# EasyEDA Pro project Source_Boat_Transmitter.epro

# Schematic Schematic1
Board Name: Board1; Create Date: 2026-06-01; Page Name: P1; Project Name: New Project_2026-06-01_17-34-28; Schematic Name: Schematic1; Update Date: 2026-06-07; Company: EasyEDA.com; Page Size: A4; Version: V1.0
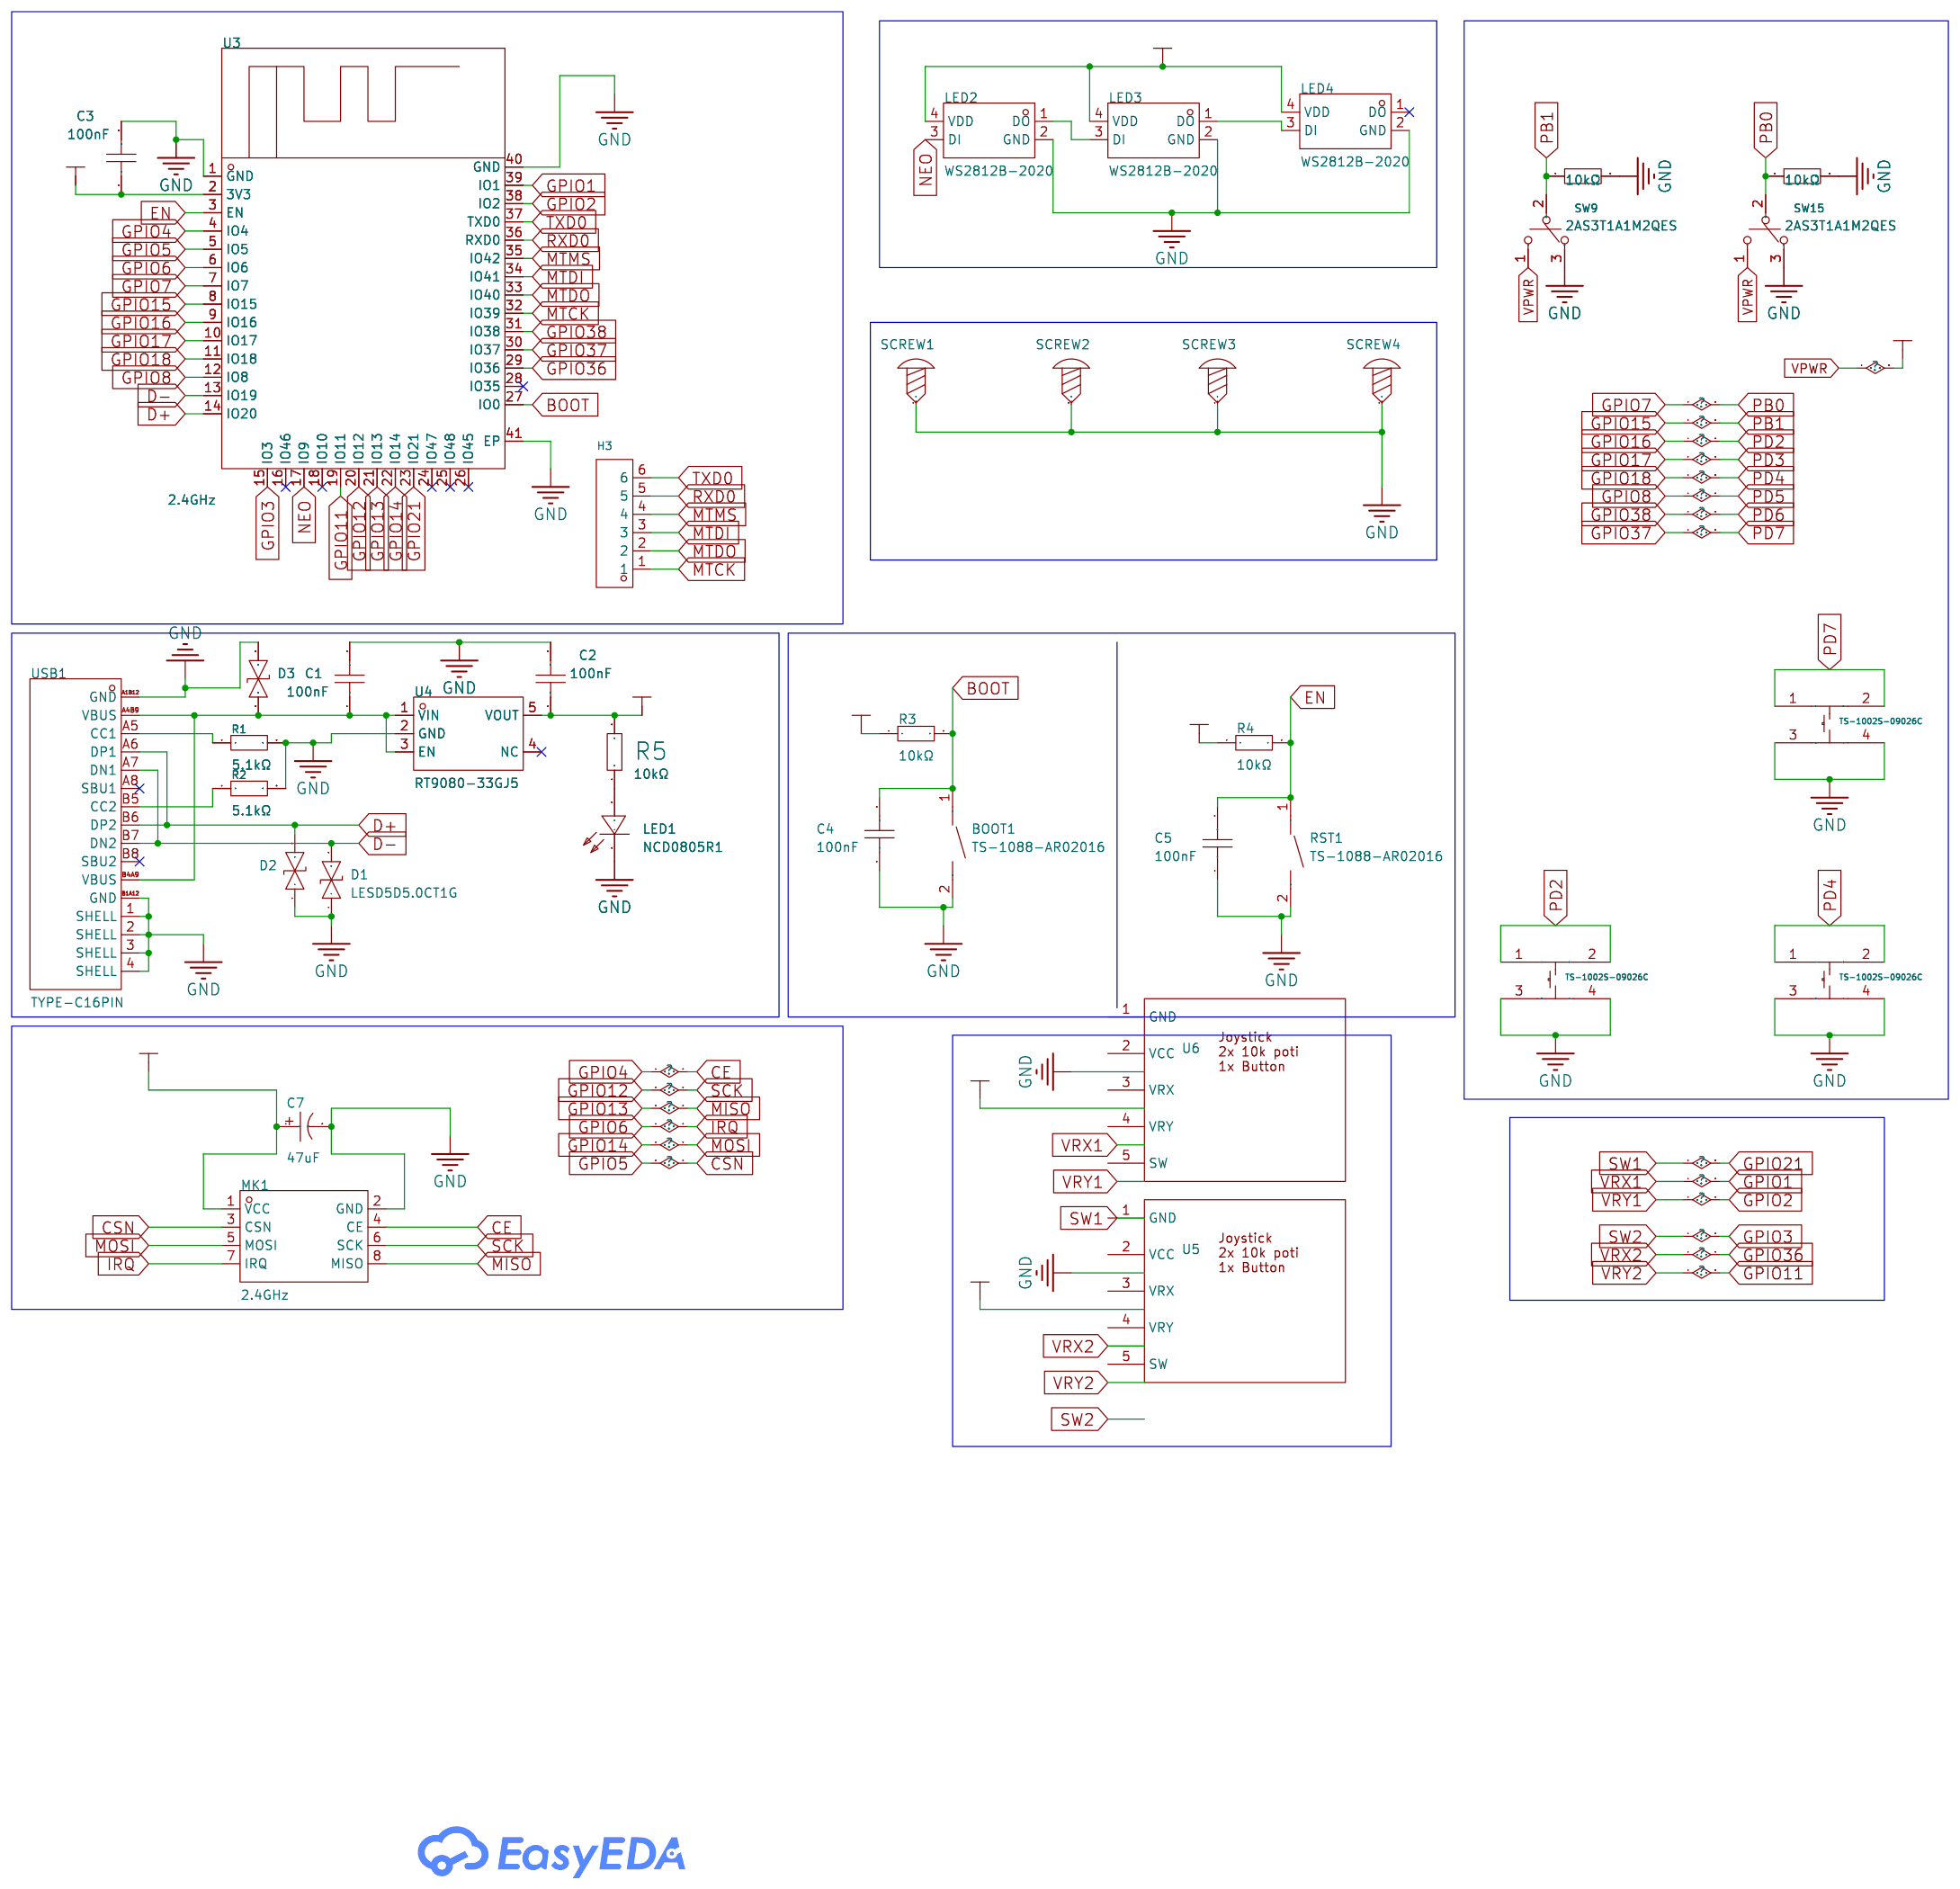
[diagram p0: schematic sheet]

## Parts
BOOT1  TS-1088-AR02016  [SW-SMD_L3.9-W3.0-P4.45]
C1  100nF  [R0603_NEW]
C2  100nF  [R0603_NEW]
C3  100nF  [R0603_NEW]
C4  100nF  [R0603_NEW]
C5  100nF  [R0603_NEW]
C7  47uF  [CAP-SMD_BD6.3-L6.6-W6.6-FD]
D1  LESD5D5.0CT1G  [SOD-523_L1.2-W0.8-LS1.6-BI]
D2  LESD5D5.0CT1G  [SOD-523_L1.2-W0.8-LS1.6-BI]
D3  LESD5D5.0CT1G  [SOD-523_L1.2-W0.8-LS1.6-BI]
H3  -  [HDR-TH_6P-P2.54-V-F]
LED1  NCD0805R1  [LED0805-RD]
LED2  WS2812B-2020  [LED-SMD_4P-L2.0-W2.0-TL_WS2812B-2020]
LED3  WS2812B-2020  [LED-SMD_4P-L2.0-W2.0-TL_WS2812B-2020]
LED4  WS2812B-2020  [LED-SMD_4P-L2.0-W2.0-TL_WS2812B-2020]
MK1  2.4GHz  [WIRELM-SMD_L28.6-W15.3-P2.54_NRF24L01]
R1  5.1kΩ  [R0603_NEW]
R2  5.1kΩ  [R0603_NEW]
R3  10kΩ  [R0603_NEW]
R4  10kΩ  [R0603_NEW]
R5  10kΩ  [R0603]
R33  10kΩ  [R0603_NEW]
R40  10kΩ  [R0603]
RST1  TS-1088-AR02016  [SW-SMD_L3.9-W3.0-P4.45]
SCREW1  -  [Screw-Hole-M3]
SCREW2  -  [Screw-Hole-M3]
SCREW3  -  [Screw-Hole-M3]
SCREW4  -  [Screw-Hole-M3]
SW5  TS-1002S-09026C  [KEY-SMD_4P-L6.0-W6.0-P4.50-LS9.5-BR]
SW9  2AS3T1A1M2QES  [SW-TH_2AS3T1A1M2QES]
SW11  TS-1002S-09026C  [KEY-SMD_4P-L6.0-W6.0-P4.50-LS9.5-BR]
SW14  TS-1002S-09026C  [KEY-SMD_4P-L6.0-W6.0-P4.50-LS9.5-BR]
SW15  2AS3T1A1M2QES  [SW-TH_2AS3T1A1M2QES]
U3  2.4GHz  [WIRELM-SMD_L25.5-W18.0-P1.27_ESP32-S3-WROOM-2-N32R16V]
U4  RT9080-33GJ5  [TSOT-23-5_L2.9-W1.6-P0.95-LS2.8-BL]
U5  -  [joystick]
U6  -  [joystick]
USB1  TYPE-C16PIN  [USB-C-SMD_TYPE-C16PIN]

## Library data of the parts
BOOT1 RST1 = TS-1088-AR02016: Circuit:SPST Actuator Style:Round Button Operating Force:160gf Mounting Style:Brick nogging Switch Length:4mm Switch Width:3mm Switch Height:2mm Strike Gundam:不带 Contact Current:50mA Voltage Rating (DC):12V Insulation Resistance:100MΩ Actuator/Cap Color:B; LCSC Part Name: 4*3*2mm 立贴 轻触开关; Supplier Part: C720477; Manufacturer: XUNPU(讯普); Supplier Footprint: SMD; JLCPCB Part Class: Basic Part; Datasheet: https://atta.szlcsc.com/upload/public/pdf/source/20200810/C720475_60D09DD6C54279ADDB2DC25100F1CC11.pdf; Supplier: LCSC; Circuit: SPST; Actuator Style: Round Button; Operating Force: 160gf; Mounting Style: Brick nogging; Switch Length: 4mm; Switch Width: 3mm; Switch Height: 2mm; Strike Gundam: 不带; Contact Current: 50mA; Voltage Rating (DC): 12V; Insulation Resistance: 100MΩ; Actuator/Cap Color: Black; Pin Style: SMDSplicing; Mechanical Life: 10万次; Operating Temperature: -30℃~+80℃
C1 C2 C4 C5 = C0805B104K500NT: Capacitance:100nF Tolerance:±10% Tolerance:±10% Voltage Rating:50V Temperature Coefficient:X7R; LCSC Part Name: 100nF ±10% 50V; Supplier Part: C113803; Manufacturer: TORCH(火炬); Supplier Footprint: 0805; JLCPCB Part Class: Extended Part; Datasheet: https://atta.szlcsc.com/upload/public/pdf/source/20191230/C476766_171E30D5B7F7164A8210B8E948DFBAE0.pdf; Supplier: LCSC; Tolerance: ±10%; Voltage Rating: 50V; Temperature Coefficient: X7R
C3 = C0805B104K500NT: Capacitance:100nF Tolerance:±10% Tolerance:±10% Voltage Rating:50V Temperature Coefficient:X7R; LCSC Part Name: 100nF ±10% 50V; Supplier Part: C476766; Manufacturer: TORCH(火炬); Supplier Footprint: 0805; JLCPCB Part Class: Extended Part; Datasheet: https://atta.szlcsc.com/upload/public/pdf/source/20191230/C476766_171E30D5B7F7164A8210B8E948DFBAE0.pdf; Supplier: LCSC; Tolerance: ±10%; Voltage Rating: 50V; Temperature Coefficient: X7R
C7 = RVT1V470M0605_C72522: Capacitance: Tolerance:±20% Tolerance:±20% Rated Voltage: Ripple Current:54mA@120Hz Equivalent Series Resistance(ESR):- φD: L: Lifetime @ Temp:2000hrs@105℃ Operating Temperature:-40℃~+105℃ Operating Temperature:-40℃~+105℃; LCSC Part Name: 47uF ±20% 35V; Supplier Part: C72522; Manufacturer: ROQANG(容强); Manufacturer Part: RVT1V470M0605; Supplier Footprint: SMD,D6.3xL5.4mm; JLCPCB Part Class: Extended Part; Datasheet: https://atta.szlcsc.com/upload/public/pdf/source/20170325/1490427950282.pdf; Supplier: LCSC; Tolerance: ±20%; Ripple Current: 54mA@120Hz; Lifetime @ Temp: 2000hrs@105℃; Operating Temperature: -40℃~+105℃
D1-D3 = LESD5D5.0CT1G: Polarity:Bidirectional Reverse Stand-Off Voltage (Vrwm):5V Clamping Voltage:18.6V Peak Pulse Current (Ipp):9.4A Voltage - Breakdown:5.6V Type:ESD; LCSC Part Name: 双向ESD; Supplier Part: C383211; Manufacturer: LRC(乐山无线电); Supplier Footprint: SOD-523; JLCPCB Part Class: Extended Part; Datasheet: https://atta.szlcsc.com/upload/public/pdf/source/20190807/C383211_633DF4B4E2C161403226E5235FE33A1C.pdf; Supplier: LCSC; Polarity: Bidirectional; Reverse Stand-Off Voltage (Vrwm): 5V; Clamping Voltage: 18.6V; Peak Pulse Current (Ipp): 9.4A; Voltage - Breakdown: 5.6V; Type: ESD
H3 = HDR-F_2.54_1x6P: Supplier Footprint: Through
LED1 = NCD0805R1_C84256: Lamp Holder Type:- Illumination Color:Red Voltage - Forward(Vf):1.6V~2.6V Voltage - Forward(Vf):1.6V~2.6V Power(Watts):65mW Forward Current:25mA Wavelength - Dominant:615nm~630nm Wavelength - Dominant:615nm~630nm Peak Wavelength:630nm Diode Configuration:; LCSC Part Name: 片式发光二极管; Supplier Part: C84256; Manufacturer: 国星光电; Supplier Footprint: 0805; JLCPCB Part Class: Basic Part; Datasheet: https://item.szlcsc.com/datasheet/NCD0805R1/85425.html; Supplier: LCSC; Illumination Color: Red; Voltage - Forward(Vf): 1.6V~2.6V; Power(Watts): 65mW; Forward Current: 25mA; Wavelength - Dominant: 615nm~630nm; Peak Wavelength: 630nm; Diode Configuration: Discrete Diode; Luminous Intensity: 195mcd; Viewing Angle: 130°; Operating Temperature: -30℃~+85℃
LED2-LED4 = WS2812B-2020: Wavelength:515.6nm；622.5nm；470.4nm Luminous Intensity:- Fixed-Frequency Pwm Mode:- Data Transmission Rate:- Supply Voltage:- Supply Voltage:- Quiescent Dissipation:- Lens Color:-; LCSC Part Name: RGB三色; Supplier Part: C965555; Manufacturer: worldsemi; Supplier Footprint: SMD,2x2mm; JLCPCB Part Class: Extended Part; Datasheet: https://atta.szlcsc.com/upload/public/pdf/source/20241202/DEE3FC25B8AD87F3BB1718ACD77EDECD.pdf; Supplier: LCSC; Wavelength: 515.6nm；622.5nm；470.4nm
MK1 = NF-04: Model:Transmit and receive Frequency:2.4GHz Modulation System:GFSK Output Power(Max):4dBm Output Power(Max):4dBm Interface Type:SPI Voltage - Supply:1.9V~3.6V Voltage - Supply:1.9V~3.6V Antenna Type:On-board PCB antenna Receive  Current:16.5mA Send  Curre; LCSC Part Name: NF-04 功率加强版 绑定 2.4G无线模块; Supplier Part: C90751; Manufacturer: Ai-Thinker(安信可); Supplier Footprint: 插件; JLCPCB Part Class: Extended Part; Datasheet: https://item.szlcsc.com/datasheet/NF-04/91939.html; Supplier: LCSC; Model: Transmit and receive; Modulation System: GFSK; Output Power(Max): 4dBm; Interface Type: SPI; Voltage - Supply: 1.9V~3.6V; Antenna Type: On-board PCB antenna; Receive  Current: 16.5mA; Send  Current: 18mA; Sensitivity: -96dBm; Operating Temperature: -20℃~+70℃
R1 R2 = RMC08055.1K1%N: Resistance:5.1kΩ Tolerance:±1% Tolerance:±1% Power(Watts):0.125W; LCSC Part Name: 5.1kΩ ±1% 125mW; Supplier Part: C23186; Manufacturer: Tyohm(幸亚电阻); Supplier Footprint: 0805; JLCPCB Part Class: Extended Part; Datasheet: https://atta.szlcsc.com/upload/public/pdf/source/20190115/C325956_D27151D492FFB3C9AB4A6F14FE01F30A.pdf; Supplier: LCSC; Tolerance: ±1%; Power(Watts): 0.125W
R3 R4 = PTFR0805B10K0N9: Type:Thin Film Resistor Resistance:10kΩ Tolerance:±0.1% Tolerance:±0.1% Power(Watts):130mW Voltage-Supply(Max):150V Temperature Coefficient:±10ppm/℃ Temperature Coefficient:±10ppm/℃ Operating Temperature:-55℃~+125℃ Operating Temperature:-55℃~+125℃; LCSC Part Name: 薄膜电阻 10kΩ ±0.1% 130mW 车规级; Supplier Part: C99198; Manufacturer: RESI(开步睿思); Supplier Footprint: 0805; JLCPCB Part Class: Extended Part; Datasheet: https://atta.szlcsc.com/upload/public/pdf/source/20240506/11BDC7478D84177AC2A5326A65B6EB29.pdf; Supplier: LCSC; Type: Thin Film Resistor; Tolerance: ±0.1%; Power(Watts): 130mW; Voltage-Supply(Max): 150V; Temperature Coefficient: ±10ppm/℃; Operating Temperature: -55℃~+125℃
R5 = 0603WAF1002T5E: Type:Thick Film Resistor Resistance:10kΩ Tolerance:±1% Tolerance:±1% Power(Watts):100mW Voltage-Supply(Max):75V Temperature Coefficient:±100ppm/℃ Temperature Coefficient:±100ppm/℃ Operating Temperature:-55℃~+155℃ Operating Temperature:-55℃~+155℃; LCSC Part Name: 厚膜电阻 10kΩ ±1% 100mW; Supplier Part: C99198; Manufacturer: UNI-ROYAL(厚声); Supplier Footprint: 0603; JLCPCB Part Class: Basic Part; Datasheet: https://atta.szlcsc.com/upload/public/pdf/source/20200306/C422600_1E6D84923E4A46A82E41ADD87F860B5C.pdf; Supplier: LCSC; Type: Thick Film Resistor; Tolerance: ±1%; Power(Watts): 100mW; Voltage-Supply(Max): 75V; Temperature Coefficient: ±100ppm/℃; Operating Temperature: -55℃~+155℃
R33 R40 = RC0603JR-0710KL: Type:Thick Film Resistors Resistance: Tolerance:±5% Tolerance:±5% Power(Watts): Overload Voltage (Max): Temperature Coefficient:±100ppm/℃ Temperature Coefficient:±100ppm/℃ Operating Temperature Range:-55℃~+155℃ Operating Temperature Range:-55℃~+155℃; LCSC Part Name: 厚膜电阻 10kΩ ±5% 100mW; Supplier Part: C99198; Manufacturer: YAGEO(国巨); Supplier Footprint: 0603; JLCPCB Part Class: Extended Part; Datasheet: https://atta.szlcsc.com/upload/public/pdf/source/20181223/C99198_917934A193F41F77D9F7D214A8C79116.pdf; Supplier: LCSC; Type: Thick Film Resistors; Tolerance: ±5%; Temperature Coefficient: ±100ppm/℃; Operating Temperature Range: -55℃~+155℃
SCREW1-SCREW4 = Screw-Hole-M3: Supplier Footprint: 插件
SW5 SW11 SW14 = TS-1002S-09026C: Circuit:SPST Actuator Style:Round Button Mounting Type:Surface Mount,Vertical Length:6mm Width:6mm Switch Height:9mm Contact Current:50mA Voltage Rating:12V With Lamp:- Life:-; LCSC Part Name: 6*6*9mm 立贴 轻触开关; Supplier Part: C455118; Manufacturer: XUNPU(讯普); Supplier Footprint: SMD-4P,6x6mm; Datasheet: https://item.szlcsc.com/datasheet/TS-1002S-09026C/457523.html; Supplier: LCSC; Circuit: SPST; Actuator Style: Round Button; Mounting Type: Surface Mount,Vertical; Length: 6mm; Width: 6mm; Switch Height: 9mm; Contact Current: 50mA; Voltage Rating: 12V
SW9 SW15 = 2AS3T1A1M2QES: Circuit:SPDT Life:30,000 Cycles Actuator Type:Cylinder Lever Termination Style:PC Pin Mounting Type:Through Hole Operating Temperature:-40℃~+85℃ Operating Temperature:-40℃~+85℃; LCSC Part Name: 2A系列 钮子开关 摇头开关; Supplier Part: C908284; Manufacturer: Dailywell(德利威); Supplier Footprint: 插件; JLCPCB Part Class: Extended Part; Datasheet: https://item.szlcsc.com/datasheet/2AS3T1A1M2QES/974703.html; Supplier: LCSC; Circuit: SPDT; Life: 30,000 Cycles; Actuator Type: Cylinder Lever; Termination Style: PC Pin; Mounting Type: Through Hole; Operating Temperature: -40℃~+85℃
U3 = ESP32-S3-WROOM-1-N8: Core Processor:ESP32-S3 Chip Support Interface:I2C；GPIO；SPI；PWM；ADC；UART；USB；I2S Frequency:2.4GHz; LCSC Part Name: 通用型Wi-Fi+低功耗蓝牙MCU模组; Supplier Part: C2913198; Manufacturer: ESPRESSIF(乐鑫); Supplier Footprint: SMD,18x25.5mm; JLCPCB Part Class: Extended Part; Datasheet: https://atta.szlcsc.com/upload/public/pdf/source/20221026/9A44C6421221D672346AAE72DF9F8146.pdf; Supplier: LCSC; Core Processor: ESP32-S3 Chip; Support Interface: I2C；GPIO；SPI；PWM；ADC；UART；USB；I2S
U4 = RT9080-33GJ5: Output Type:Fixed Maximum Input Voltage:5.5V Output Voltage:3.3V Output Voltage:3.3V Output Current:600mA Power Supply Rejection Ratio (PSRR):75dB@(1kHz) Dropout Voltage:530mV@(600mA) standby current:4uA Feature:ESD Protection；Thermal Protection(TSD)；Over; Supplier Part: C841192; Manufacturer: RICHTEK(立锜); Supplier Footprint: TSOT-23-5; JLCPCB Part Class: Extended Part; Datasheet: https://atta.szlcsc.com/upload/public/pdf/source/20200918/C841192_D291BBB33AFC8816B317CCB22A728955.pdf; Supplier: LCSC; Output Type: Fixed; Maximum Input Voltage: 5.5V; Output Voltage: 3.3V; Output Current: 600mA; Power Supply Rejection Ratio (PSRR): 75dB@(1kHz); Dropout Voltage: 530mV@(600mA); standby current: 4uA; Feature: ESD Protection；Thermal Protection(TSD)；Overcurrent Protection(OCP)；With ability; Operating Temperature: -40℃~+85℃@(Ta); Output Polarity: Positive electrode; Number of Outputs: 1
U5 U6 = joystick
USB1 = TYPE-C16PIN: Connector Type:Type-C Protocol Standard:USB 3.1 Gender:Female Mounting Type:Surface Mount, Right Angle Number of Contacts:16P Number of Ports:1 Current Rating-Power:3A Voltage Rating:30V Connect-Disconnect Life:10,000 Cycles Detection color:Black Operatin; LCSC Part Name: Type-C 母 卧贴; Supplier Part: C393939; Manufacturer: SHOU HAN(首韩); Supplier Footprint: SMD; JLCPCB Part Class: Extended Part; Datasheet: https://atta.szlcsc.com/upload/public/pdf/source/20250618/9FBF2A26CFCE0E69298FA0B726710E9E.pdf; Supplier: LCSC; Connector Type: Type-C; Protocol Standard: USB 3.1; Gender: Female; Mounting Type: Surface Mount, Right Angle; Number of Contacts: 16P; Number of Ports: 1; Current Rating-Power: 3A; Voltage Rating: 30V; Connect-Disconnect Life: 10,000 Cycles; Detection color: Black; Operating Temperature: -40℃~+85℃

## Nets
+3.3V: C2.1 C3.1 C7.1 LED2.4(VDD) LED3.4(VDD) LED4.4(VDD) MK1.1(VCC) R3.1 R4.1 R5.2 SW9.1 SW15.1 U3.2(3V3) U4.5(VOUT)
GND: BOOT1.2 C1.2 C2.2 C3.2 C4.1 C5.1 C7.2 D1.1 D2.1 D3.2 LED1.2(-) LED2.2(GND) LED3.2(GND) LED4.2(GND) MK1.2(GND) R1.2 R2.2 R33.2 R40.2 RST1.2 SCREW1.1 SCREW2.1 SCREW3.1 SCREW4.1 SW5.3 SW5.4 SW9.3 SW11.3 SW11.4 SW14.3 SW14.4 SW15.3 U3.1(GND) U3.40(GND) U3.41(EP) U4.2(GND) USB1.1(SHELL) USB1.2(SHELL) USB1.3(SHELL) USB1.4(SHELL) USB1.A1B12(GND) USB1.B1A12(GND)
BOOT: BOOT1.1 C4.2 R3.2 U3.27(IO0)
CE: MK1.4(CE) U3.4(IO4)
CSN: MK1.3(CSN) U3.5(IO5)
D+: D2.2 U3.14(IO20) USB1.A6(DP1) USB1.B6(DP2)
D-: D1.2 U3.13(IO19) USB1.A7(DN1) USB1.B7(DN2)
EN: C5.2 R4.2 RST1.1 U3.3(EN)
GPIO1: U3.39(IO1)
GPIO2: U3.38(IO2)
GPIO3: U3.15(IO3)
GPIO6: MK1.7(IRQ) U3.6(IO6)
GPIO7: R40.1 SW15.2 U3.7(IO7)
GPIO8: U3.12(IO8)
GPIO11: U3.19(IO11)
GPIO12: MK1.6(SCK) U3.20(IO12)
GPIO13: MK1.8(MISO) U3.21(IO13)
GPIO14: MK1.5(MOSI) U3.22(IO14)
GPIO15: R33.1 SW9.2 U3.8(IO15)
GPIO16: SW5.1 SW5.2 U3.9(IO16)
GPIO17: U3.10(IO17)
GPIO18: SW11.1 SW11.2 U3.11(IO18)
GPIO21: U3.23(IO21)
GPIO36: U3.29(IO36)
GPIO37: SW14.1 SW14.2 U3.30(IO37)
GPIO38: U3.31(IO38)
MTCK: H3.1 U3.32(IO39)
MTDI: H3.3 U3.34(IO41)
MTDO: H3.2 U3.33(IO40)
MTMS: H3.4 U3.35(IO42)
NEO: LED2.3(DI) U3.17(IO9)
RXD0: H3.5 U3.36(RXD0)
TXD0: H3.6 U3.37(TXD0)
$1N5142: C1.1 D3.1 U4.1(VIN) U4.3(EN) USB1.A4B9(VBUS) USB1.B4A9(VBUS)
$1N5148: R1.1 USB1.A5(CC1)
$1N5149: R2.1 USB1.B5(CC2)
$1N5165: LED1.1(+) R5.1
$1N5231: LED2.1(DO) LED3.3(DI)
$1N5232: LED3.1(DO) LED4.3(DI)

Not connected (* = marked no-connect by the designer): LED4 1(DO)*; U3 16(IO46)* 18(IO10)* 24(IO47)* 25(IO48)* 26(IO45)* 28(IO35)*; U4 4(NC)*; U5 1(GND) 2(VCC) 3(VRX) 4(VRY) 5(SW); U6 1(GND) 2(VCC) 3(VRX) 4(VRY) 5(SW); USB1 A8(SBU1)* B8(SBU2)*

# Board PCB1
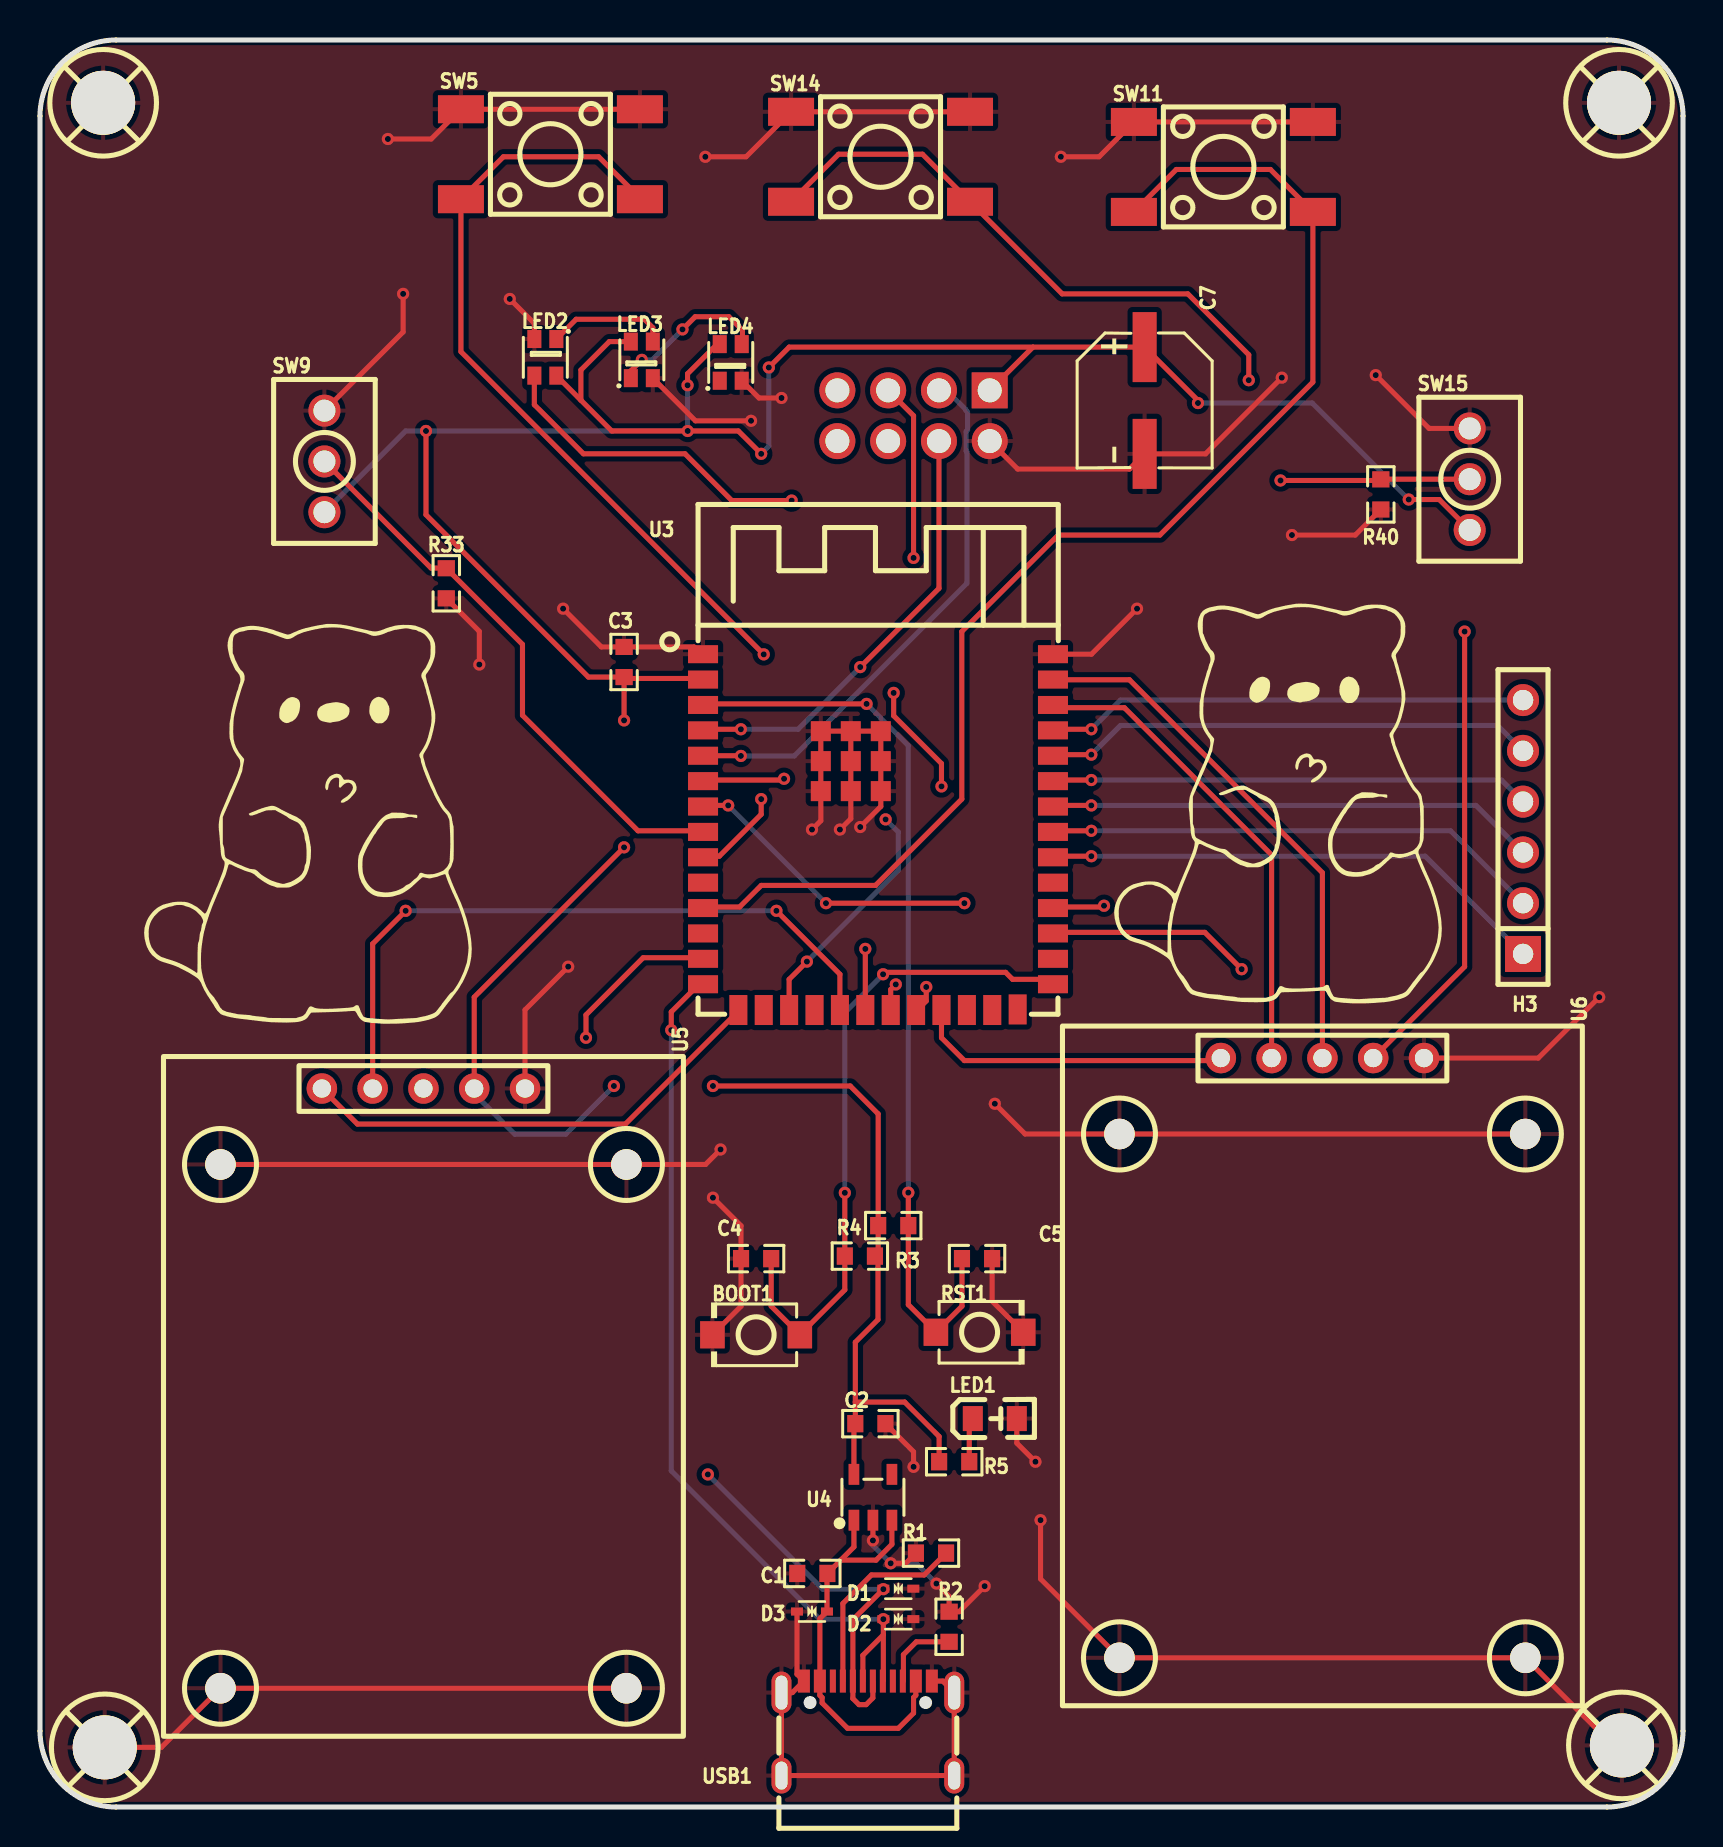
[diagram p1: board, top side]
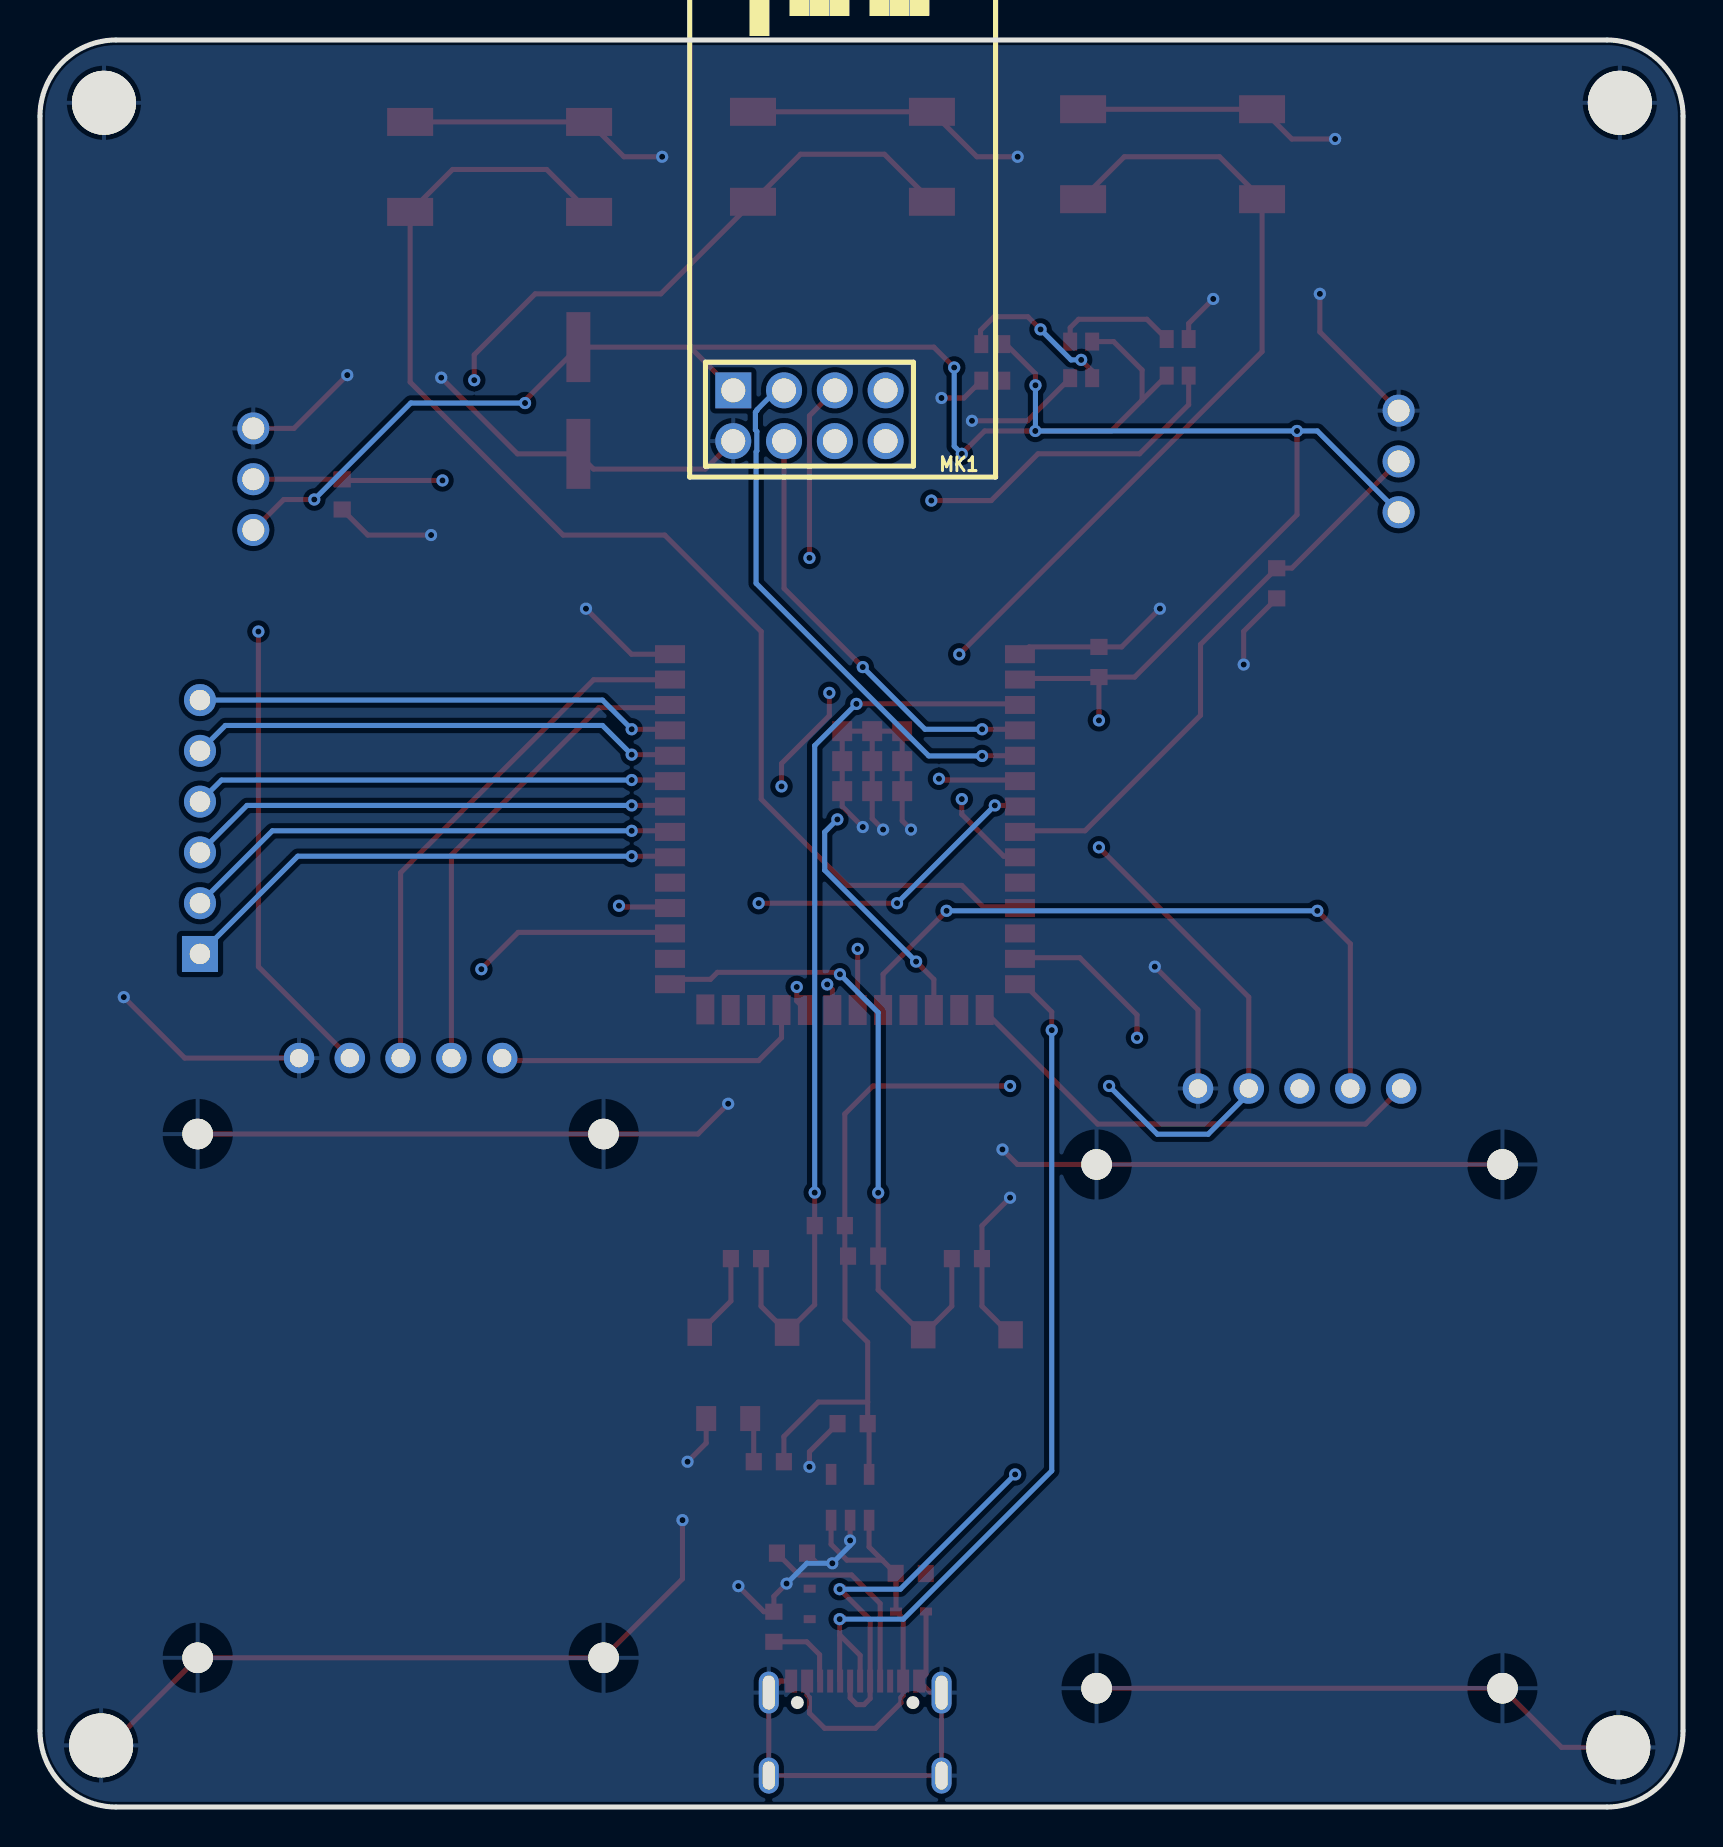
[diagram p2: board, bottom side, seen from below]

Outline 82.17 x 88.39 mm; copper layers: Top Layer, Inner1, Inner2, Bottom Layer. Coordinates in mm from the lower left corner of the outline.
Outline path: 0,84.58 0,3.81 arc(1.12,1.12) 3.81,0 78.36,0 arc(81.05,1.12) 82.17,3.81 82.17,84.58 arc(81.05,87.28) 78.36,88.39 3.81,88.39 arc(1.12,87.28) 0,84.58
Stack: Top Layer 0.035mm Outer layer thickness 1oz / Dielectric1 0.2104mm 7628 RC49% 8.6mil / Inner1 0.0152mm Inner layer thickness / Dielectric2 1.065mm 1.1mm H/HOZ Copper / Inner2 0.0152mm Inner layer thickness / Dielectric3 0.2104mm 7628 RC49% 8.6mil / Bottom Layer 0.035mm Outer layer thickness 1oz

## Design rules (mm)
template: JLCPCB Capability(Two Layers Board)
spacing copperThickness1oz (default): track to track 0.102, other pairs 0.152 to 0.3
spacing copperThickness2oz: track to track 0.203, other pairs 0.152 to 0.3
track width copperThickness1oz (default): min 0.127, default 0.254, max 2.54
track width copperThickness2oz: min 0.203, default 0.254, max 2.54
differential pair differentialPair (default): width min 0.127, default 0.254, max 2.54; gap min 0.152, default 0.152
via viaSize (default): diameter min 0.5, default 0.61, max 10; hole min 0.3, default 0.305, max 6.3

## Placement (name value [footprint] x y rotation side)
BOOT1  TS-1088-AR02016  [SW-SMD_L3.9-W3.0-P4.45]  35.81 23.62 180 top
C1  100nF  [R0603_NEW]  38.63 11.68 180 top
C2  100nF  [R0603_NEW]  41.53 19.18 0 top
C3  100nF  [R0603_NEW]  29.21 57.28 90 top
C4  100nF  [R0603_NEW]  35.81 27.43 0 top
C5  100nF  [R0603_NEW]  46.86 27.43 180 top
C7  47uF  [CAP-SMD_BD6.3-L6.6-W6.6-FD]  55.24 70.36 270 top
D1  LESD5D5.0CT1G  [SOD-523_L1.2-W0.8-LS1.6-BI]  42.93 10.92 180 top
D2  LESD5D5.0CT1G  [SOD-523_L1.2-W0.8-LS1.6-BI]  42.93 9.4 180 top
D3  LESD5D5.0CT1G  [SOD-523_L1.2-W0.8-LS1.6-BI]  38.61 9.78 180 top
H3  -  [HDR-TH_6P-P2.54-V-F]  74.17 49.02 90 top
LED1  NCD0805R1  [LED0805-RD]  47.75 19.43 0 top
LED2  WS2812B-2020  [LED-SMD_4P-L2.0-W2.0-TL_WS2812B-2020]  25.27 72.52 270 top
LED3  WS2812B-2020  [LED-SMD_4P-L2.0-W2.0-TL_WS2812B-2020]  30.1 72.39 90 top
LED4  WS2812B-2020  [LED-SMD_4P-L2.0-W2.0-TL_WS2812B-2020]  34.54 72.26 90 top
MK1  2.4GHz  [WIRELM-SMD_L28.6-W15.3-P2.54_NRF24L01]  43.69 69.6 0 bottom
R1  5.1kΩ  [R0603_NEW]  44.56 12.7 180 top
R2  5.1kΩ  [R0603_NEW]  45.47 9.02 90 top
R3  10kΩ  [R0603_NEW]  41 27.56 180 top
R4  10kΩ  [R0603_NEW]  42.67 29.08 0 top
R5  10kΩ  [R0603]  45.72 17.27 180 top
R33  10kΩ  [R0603_NEW]  20.32 61.21 270 top
R40  10kΩ  [R0603]  67.06 65.66 270 top
RST1  TS-1088-AR02016  [SW-SMD_L3.9-W3.0-P4.45]  46.99 23.75 0 top
SCREW1  -  [Screw-Hole-M3]  3.3 2.92 0 top
SCREW2  -  [Screw-Hole-M3]  79.18 3.02 0 top
SCREW3  -  [Screw-Hole-M3]  3.22 85.19 0 top
SCREW4  -  [Screw-Hole-M3]  79.03 85.19 0 top
SW5  TS-1002S-09026C  [KEY-SMD_4P-L6.0-W6.0-P4.50-LS9.5-BR]  25.53 82.68 0 top
SW9  2AS3T1A1M2QES  [SW-TH_2AS3T1A1M2QES]  14.22 67.31 0 top
SW11  TS-1002S-09026C  [KEY-SMD_4P-L6.0-W6.0-P4.50-LS9.5-BR]  59.18 82.04 0 top
SW14  TS-1002S-09026C  [KEY-SMD_4P-L6.0-W6.0-P4.50-LS9.5-BR]  42.04 82.55 0 top
SW15  2AS3T1A1M2QES  [SW-TH_2AS3T1A1M2QES]  71.5 66.42 0 top
U3  2.4GHz  [WIRELM-SMD_L25.5-W18.0-P1.27_ESP32-S3-WROOM-2-N32R16V]  41.91 48.77 0 top
U4  RT9080-33GJ5  [TSOT-23-5_L2.9-W1.6-P0.95-LS2.8-BL]  41.66 15.49 0 top
U5  -  [joystick]  19.18 35.94 270 top
U6  -  [joystick]  64.14 37.46 270 top
USB1  TYPE-C16PIN  [USB-C-SMD_TYPE-C16PIN]  41.4 3.94 0 top

## Footprints (pads in the part's own frame, mm; a bottom-side part is the same pattern mirrored in y, then rotated)
CAP-SMD_BD6.3-L6.6-W6.6-FD
  rect 3.5x1.2 smd: 1(-2.67,0) 2(2.67,0)
HDR-TH_6P-P2.54-V-F
  rect 1.8x1.8 hole 1.02: 1(-6.35,0)
  round 1.6 hole 1.02: 2(-3.81,0) 3(-1.27,0) 4(1.27,0) 5(3.81,0) 6(6.35,0)
joystick
  round 1.524 hole 0.914: 1(0,5.08) 2(0,2.54) 3(0,0) 4(0,-2.54) 5(0,-5.08)
  round 1.524 hole 3: 1(3.8,10.15) 1(3.8,-10.15) 1(30,-10.15)
  round 1.524 hole 4x3: 1(30,10.15)
KEY-SMD_4P-L6.0-W6.0-P4.50-LS9.5-BR
  rect 2.3x1.4 smd: 1(4.475,-2.25) 2(-4.475,-2.25) 3(4.475,2.25) 4(-4.475,2.25)
LED0805-RD
  rect 1x1.25 smd: 1(-1.1,0) 2(1.1,0)
LED-SMD_4P-L2.0-W2.0-TL_WS2812B-2020
  rect 0.9x0.7 smd: 1(-0.915,0.55) 2(-0.915,-0.55) 3(0.915,-0.55) 4(0.915,0.55)
R0603
  rect 0.806x0.864 smd: 1(-0.753,0) 2(0.753,0)
R0603_NEW
  rect 0.806x0.864 smd: 1(-0.753,0) 2(0.753,0)
Screw-Hole-M3
  round 3.2 hole 3.2: 1(-0.064,0.064)
SOD-523_L1.2-W0.8-LS1.6-BI
  rect 0.6x0.4 smd: 1(-0.75,0) 2(0.75,0)
SW-SMD_L3.9-W3.0-P4.45
  rect 1.23x1.36 smd: 1(-2.185,0) 2(2.185,0)
SW-TH_2AS3T1A1M2QES
  round 1.6 hole 1.1: 1(0,-2.54) 2(0,0) 3(0,2.54)
TSOT-23-5_L2.9-W1.6-P0.95-LS2.8-BL
  rect 0.532x1.045 smd: 1(-0.95,-1.147) 2(0,-1.147) 3(0.95,-1.147) 4(0.95,1.147) 5(-0.95,1.147)
USB-C-SMD_TYPE-C16PIN
  oval 1x2.1 hole 0.6x1.7: 1(-4.32,1.788) 2(4.32,1.788)
  oval 1x1.8 hole 0.6x1.4: 3(-4.32,-2.362) 4(4.32,-2.362)
  rect 0.6x1.15 smd: A1B12(-3.2,2.362) A4B9(-2.4,2.362) B1A12(3.2,2.362) B4A9(2.4,2.362)
  rect 0.3x1.15 smd: A5(-1.25,2.362) A6(-0.25,2.362) A7(0.25,2.362) A8(1.25,2.362) B5(1.75,2.362) B6(0.75,2.362) B7(-0.75,2.362) B8(-1.75,2.362)
WIRELM-SMD_L25.5-W18.0-P1.27_ESP32-S3-WROOM-2-N32R16V
  rect 1.5x0.9 smd: 1(-8.75,8.9) 2(-8.75,7.63) 3(-8.75,6.36) 4(-8.75,5.09) 5(-8.75,3.82) 6(-8.75,2.55) 7(-8.75,1.28) 8(-8.75,0.01) 9(-8.75,-1.26) 10(-8.75,-2.53) 11(-8.75,-3.8) 12(-8.75,-5.07) 13(-8.75,-6.34) 14(-8.75,-7.61) 27(8.75,-7.61) 28(8.75,-6.34) 29(8.75,-5.07) 30(8.75,-3.8) 31(8.75,-2.53) 32(8.75,-1.26) 33(8.75,0.01) 34(8.75,1.28) 35(8.75,2.55) 36(8.75,3.82) 37(8.75,5.09) 38(8.75,6.36) 39(8.75,7.63) 40(8.75,8.9)
  rect 0.9x1.5 smd: 15(-6.985,-8.9) 16(-5.715,-8.9) 17(-4.445,-8.9) 18(-3.175,-8.9) 19(-1.905,-8.9) 20(-0.635,-8.9) 21(0.635,-8.9) 22(1.905,-8.9) 23(3.175,-8.9) 24(4.445,-8.9) 25(5.715,-8.9) 26(6.985,-8.87)
  rect 1x1 smd: 41(-2.86,5.05) 41(-2.86,3.55) 41(-2.86,2.05) 41(-1.36,5.05) 41(-1.36,3.55) 41(-1.36,2.05) 41(0.14,5.05) 41(0.14,3.55) 41(0.14,2.05)
WIRELM-SMD_L28.6-W15.3-P2.54_NRF24L01
  rect 1.8x1.8 hole 1.2: 1(3.808,-1.27)
  round 1.8 hole 1.2: 2(3.81,1.27) 3(1.27,-1.27) 4(1.27,1.27) 5(-1.27,-1.27) 6(-1.27,1.27) 7(-3.81,-1.27) 8(-3.81,1.27)

## Nets
+3.3V: C2.1 C3.1 C7.1 LED2.4 LED3.4 LED4.4 MK1.1 R3.1 R4.1 R5.2 SW9.1 SW15.1 U3.2 U4.5 U5.2 U6.2
GND: BOOT1.2 C1.2 C2.2 C3.2 C4.1 C5.1 C7.2 D1.1 D2.1 D3.2 LED1.2 LED2.2 LED3.2 LED4.2 MK1.2 R1.2 R2.2 R33.2 R40.2 RST1.2 SCREW1.1 SCREW2.1 SCREW3.1 SCREW4.1 SW5.3 SW5.4 SW9.3 SW11.3 SW11.4 SW14.3 SW14.4 SW15.3 U3.1 U3.40 U3.41 U4.2 U5.1 U6.1 USB1.1 USB1.2 USB1.3 USB1.4 USB1.A1B12 USB1.B1A12
BOOT: BOOT1.1 C4.2 R3.2 U3.27
CE: MK1.4 U3.4
CSN: MK1.3 U3.5
D+: D2.2 U3.14 USB1.A6 USB1.B6
D-: D1.2 U3.13 USB1.A7 USB1.B7
EN: C5.2 R4.2 RST1.1 U3.3
GPIO1: U3.39 U6.3
GPIO2: U3.38 U6.4
GPIO3: U3.15 U5.5
GPIO6: MK1.7 U3.6
GPIO7: R40.1 SW15.2 U3.7
GPIO8: U3.12
GPIO11: U3.19 U5.4
GPIO12: MK1.6 U3.20
GPIO13: MK1.8 U3.21
GPIO14: MK1.5 U3.22
GPIO15: R33.1 SW9.2 U3.8
GPIO16: SW5.1 SW5.2 U3.9
GPIO17: U3.10
GPIO18: SW11.1 SW11.2 U3.11
GPIO21: U3.23 U6.5
GPIO36: U3.29 U5.3
GPIO37: SW14.1 SW14.2 U3.30
GPIO38: U3.31
MTCK: H3.1 U3.32
MTDI: H3.3 U3.34
MTDO: H3.2 U3.33
MTMS: H3.4 U3.35
NEO: LED2.3 U3.17
RXD0: H3.5 U3.36
TXD0: H3.6 U3.37
$1N5142: C1.1 D3.1 U4.1 U4.3 USB1.A4B9 USB1.B4A9
$1N5148: R1.1 USB1.A5
$1N5149: R2.1 USB1.B5
$1N5165: LED1.1 R5.1
$1N5231: LED2.1 LED3.3
$1N5232: LED3.1 LED4.3

Pads without a net: LED4 1; U3 16 18 24 25 26 28; U4 4; USB1 A8 B8

## Via types
v1: diameter 0.61, hole 0.305, Top Layer to Bottom Layer, 81 vias

## Routing (per net, layer and track width the routed paths; a pad name or vN(x,y) marks a point on that pad's centre or on a via; arc(x,y) is an arc through that point)
+3.3V: length 209.4
  Top Layer w0.254: U4.5 40.71,19.11 C2.1 40.78,20.26 ; v1(29.21,48.01) 21.72,40.51 U5.2 ; 27.05,70.37 28.59,68.83 v1(32.39,68.83) 34.92,68.83 v1(36.07,67.69) ; 27.05,70.37 27.05,71.88 28.47,73.3 LED3.4 ; 27.05,70.37 LED2.4 ; 49.66,73.03 37.47,73.03 v1(36.45,72.01) ; 49.66,73.03 C7.1 57.91,70.36 v1(57.91,70.23) ; 49.66,73.03 MK1.1 ; 33.99,73.18 33.87,73.18 32.39,71.7 v1(32.39,71.12) ; U6.2 71.25,42.04 v1(71.25,58.8) ; SW15.1 69.98,65.4 v1(68.45,65.4) ; 40.78,20.26 43.24,20.26 44.97,18.53 R5.2 ; 40.78,20.26 40.78,23.25 41.91,24.38 41.91,27.41 R3.1 41.92,27.72 R4.1 41.92,34.67 40.52,36.07 v1(33.66,36.07) ; C3.1 29.28,56.45 33.01,56.45 ; C3.1 27.42,56.52 19.3,64.64 v1(19.3,68.83) ; C3.1 v1(29.21,54.36)
  Inner1 w0.254: v1(29.21,48.01) v1(29.21,54.36)
  Inner2 w0.254: v1(33.66,36.07) v1(28.7,36.07) ; SW15.1 71.5,60.07 71.25,59.82 v1(71.25,58.8)
  Bottom Layer w0.254: v1(28.7,36.07) 26.29,33.65 23.75,33.65 21.72,35.69 U5.2 ; SW9.1 18.29,68.83 v1(19.3,68.83) 32.39,68.83 v1(32.39,71.12) ; v1(36.07,67.69) 36.45,68.07 v1(36.45,72.01) ; v1(68.45,65.4) 63.63,70.23 v1(57.91,70.23)
GND: length 306
  Top Layer w0.254: v1(26.42,42.04) 24.26,39.88 U5.1 ; v1(23.49,75.44) 24.72,74.21 LED2.2 ; v1(33.66,30.48) 35.06,29.07 C4.1 35.06,25.05 BOOT1.2 ; SW15.3 69.47,68.96 v1(66.8,71.63) ; v1(33.27,82.55) 35.31,82.55 SW14.4 SW14.3 ; v1(37.08,70.48) 35.96,70.48 LED4.2 ; U6.1 U6.1 49.27,33.66 v1(47.75,35.18) ; U4.2 v1(41.66,13.33) ; v1(50.04,14.35) 50.04,11.41 U6.1 U6.1 78.67,3.08 SCREW2.1 ; R1.2 43.3,12.19 v1(42.55,12.19) ; v1(41.02,49.02) 42.05,50.05 U3.41 U3.41 U3.41 U3.41 ; SW5.3 SW5.4 19.56,83.44 v1(17.4,83.44) ; 33.01,57.72 32.7,58.03 C3.2 28.08,58.03 v1(26.16,59.94) ; R40.2 65.78,63.63 v1(62.61,63.63) ; v1(49.78,17.27) 48.85,18.2 LED1.2 ; U3.41 U3.41 U3.41 40.55,49.44 v1(40.01,48.89) ; U3.41 U3.41 U3.41 U3.41 39.05,49.34 v1(38.61,48.89) ; v1(44.83,11.18) 45.47,10.54 R2.2 45.97,9.77 v1(47.24,11.05) ; U6.1 74.93,37.46 v1(77.98,40.51) ; v1(21.97,57.15) 21.97,58.81 R33.2 ; U5.1 U5.1 6.07,2.98 SCREW1.1 ; C2.2 43.69,17.77 v1(43.69,17.02) ; LED3.2 32.78,69.34 v1(35.56,69.34) ; SW9.3 18.16,73.79 v1(18.16,75.69) ; v1(51.05,82.55) 52.96,82.55 SW11.4 SW11.3 ; U5.1 U5.1 33.28,32.14 v1(34.04,32.89) ; U3.40 52.59,57.67 v1(54.86,59.94) ; C5.1 47.62,25.31 RST1.2 ; MK1.2 48.89,66.93 54.49,66.93 C7.2 58.29,67.69 v1(62.1,71.5) ; D3.2 37.86,6.64 USB1.A1B12 37.63,5.72 USB1.1 USB1.3 USB1.4 USB1.2 45.15,6.3 USB1.B1A12
  Bottom Layer w0.254: v1(41.66,13.33) 41.66,13.08 v1(42.55,12.19) 43.82,12.19 v1(44.83,11.18)
BOOT: length 33.1
  Top Layer w0.254: v1(42.16,41.66) 42.26,41.75 48.29,41.75 48.64,41.4 50.09,41.4 50.28,41.21 50.81,41.21 ; v1(40.25,30.73) 40.25,25.87 BOOT1.1 36.57,25.05 C4.2
  Bottom Layer w0.254: v1(42.16,41.66) 40.25,39.74 v1(40.25,30.73)
CE: length 22.2
  Top Layer w0.254: 33.01,53.91 v1(35.05,53.91) ; v1(41.02,57.02) 44.96,60.96 MK1.4
  Bottom Layer w0.254: v1(41.02,57.02) 37.91,53.91 v1(35.05,53.91)
CSN: length 27.3
  Top Layer w0.254: v1(35.05,52.58) 35.04,52.59 33.16,52.59
  Bottom Layer w0.254: MK1.3 45.34,70.87 46.32,69.89 46.32,69.85 46.39,69.78 46.39,68.89 46.32,68.81 46.32,67.84 46.36,67.8 46.36,61.21 37.72,52.58 v1(35.05,52.58)
D+: length 44.5
  Top Layer w0.254: USB1.B6 42.18,6.32 42.18,8.61 ; 42.18,8.61 v1(42.18,9.4) ; 42.18,8.61 41.15,7.59 USB1.A6 ; 33.01,41.21 31.57,39.77 v1(31.57,38.86)
  Bottom Layer w0.254: v1(31.57,38.86) 31.57,16.82 38.99,9.4 v1(42.18,9.4)
D-: length 51.8
  Top Layer w0.254: v1(27.3,38.48) 27.3,39.62 30.16,42.48 33.01,42.48 ; v1(42.18,10.9) 40.65,9.37 USB1.B7 40.65,5.43 40.96,5.12 41.32,5.12 41.65,5.46 USB1.A7
  Inner2 w0.254: v1(27.3,38.48) 27.3,22.73 v1(33.4,16.64)
  Bottom Layer w0.254: v1(42.18,10.9) 39.14,10.9 v1(33.4,16.64)
EN: length 45.4
  Top Layer w0.254: v1(43.43,30.73) R4.2 43.43,25.13 RST1.1 46.11,25.05 C5.2 ; 33.01,55.18 41.34,55.18
  Bottom Layer w0.254: v1(41.34,55.18) 43.43,53.09 v1(43.43,30.73)
GPIO1: length 26.6
  Top Layer w0.254: U6.3 64.14,46.74 54.48,56.39 50.87,56.39 50.81,56.45
GPIO2: length 24.1
  Top Layer w0.254: 50.81,55.18 51,54.99 54.23,54.99 61.6,47.62 U6.4
GPIO3: length 23.9
  Top Layer w0.254: 34.92,39.81 29.27,34.16 15.88,34.16 U5.5
GPIO6: length 24.8
  Top Layer w0.254: v1(37.21,51.43) 37.15,51.37 33.01,51.37
  Inner1 w0.254: v1(37.21,51.43) 38.48,52.7 38.48,69.47 MK1.7
GPIO7: length 55.5
  Top Layer w0.254: v1(62.04,66.36) 67,66.36 R40.1 67.06,66.42 SW15.2 ; 33.01,50.1 v1(34.42,50.1) ; v1(39.31,45.21) v1(46.23,45.21)
  Inner1 w0.254: v1(46.23,45.21) 51.43,45.21 57.28,51.05 57.28,61.59 v1(62.04,66.36)
  Bottom Layer w0.254: v1(39.31,45.21) v1(34.42,50.1)
GPIO11: length 34.4
  Top Layer w0.254: v1(36.83,44.83) 40.01,41.66 40.01,39.81 ; v1(18.29,44.83) 16.64,43.18 U5.4
  Bottom Layer w0.254: v1(18.29,44.83) v1(36.83,44.83)
GPIO12: length 30.7
  Top Layer w0.254: 41.27,39.81 v1(41.27,42.93)
  Inner2 w0.254: MK1.6 44.45,66.29 44.45,46.1 v1(41.27,42.93)
GPIO13: length 31.7
  Top Layer w0.254: v1(42.8,41.15) 42.55,40.89 42.55,39.81 ; v1(42.69,55.73) 42.69,54.59 45.08,52.2 v1(45.08,51.05)
  Inner1 w0.254: MK1.8 42.69,65.51 v1(42.69,55.73)
  Inner2 w0.254: v1(45.08,51.05) 45.08,43.43 v1(42.8,41.15)
GPIO14: length 32.1
  Top Layer w0.254: v1(43.69,62.48) 43.69,69.6 MK1.5 ; 43.82,39.81 44.32,40.32 v1(44.32,41.02)
  Inner1 w0.254: v1(44.32,41.02) 44.32,49.78 43.69,50.42 v1(43.69,62.48)
GPIO15: length 28.5
  Top Layer w0.254: SW9.2 19.56,61.98 20.32,61.98 ; R33.1 24.13,58.16 24.13,54.61 29.91,48.83 33.01,48.83
GPIO16: length 51.8
  Top Layer w0.254: v1(36.07,50.42) 36.07,49.66 33.97,47.56 33.01,47.56 ; v1(36.2,57.66) 21.05,72.8 SW5.2 23.17,82.55 27.94,82.55 30,80.49 SW5.1
  Inner2 w0.254: v1(36.07,50.42) 36.07,57.53 v1(36.2,57.66)
GPIO18: length 65.7
  Top Layer w0.254: 33.01,45.02 34.99,45.02 36.07,46.1 41.78,46.1 46.1,50.42 46.1,58.8 50.93,63.63 56.01,63.63 63.66,71.28 SW11.1 61.53,81.91 56.83,81.91 SW11.2
GPIO21: length 15.8
  Top Layer w0.254: 45.08,39.81 45.08,38.48 46.23,37.34 58.93,37.34 U6.5
GPIO36: length 73.4
  Top Layer w0.254: v1(60.1,41.91) 58.25,43.75 50.81,43.75
  Inner1 w0.254: U5.3 33.66,21.46 53.21,21.46 60.1,28.35 v1(60.1,41.91)
GPIO37: length 61
  Top Layer w0.254: v1(60.45,71.37) 60.45,72.64 57.4,75.69 51.12,75.69 SW14.1 44.14,82.68 39.94,82.68 SW14.2 ; 50.81,45.02 53.15,45.02 v1(53.21,45.08)
  Inner2 w0.254: v1(60.45,71.37) 60.45,52.32 v1(53.21,45.08)
MTCK: length 25.4
  Top Layer w0.254: 50.81,47.56 v1(52.58,47.56)
  Bottom Layer w0.254: H3.1 69.28,47.56 v1(52.58,47.56)
MTDI: length 24.3
  Top Layer w0.254: 50.81,50.1 v1(52.58,50.1)
  Bottom Layer w0.254: H3.3 71.82,50.1 v1(52.58,50.1)
MTDO: length 24.9
  Top Layer w0.254: 50.81,48.83 v1(52.58,48.83)
  Bottom Layer w0.254: H3.2 70.55,48.83 v1(52.58,48.83)
MTMS: length 23.8
  Top Layer w0.254: 50.81,51.37 v1(52.58,51.37)
  Bottom Layer w0.254: H3.4 73.09,51.37 v1(52.58,51.37)
NEO: length 46.3
  Top Layer w0.254: v1(38.35,42.29) 37.46,41.4 37.46,39.81 ; LED2.3 24.72,70.15 27.18,67.69 32.26,67.69 34.6,65.35 v1(37.59,65.35)
  Inner2 w0.254: v1(42.29,49.4) 40.01,51.69 40.01,62.94 v1(37.59,65.35)
  Bottom Layer w0.254: v1(38.35,42.29) 42.93,46.86 42.93,48.77 v1(42.29,49.4)
RXD0: length 24.5
  Top Layer w0.254: 50.81,52.64 v1(52.58,52.64)
  Bottom Layer w0.254: H3.5 72.9,54.1 54.04,54.1 v1(52.58,52.64)
TXD0: length 24
  Top Layer w0.254: 50.81,53.91 v1(52.58,53.91)
  Bottom Layer w0.254: H3.6 54.04,55.37 v1(52.58,53.91)
$1N5142: length 21
  Top Layer w0.254: 40.04,12.35 41.81,12.35 42.61,13.14 42.61,14.35 ; 40.04,12.35 40.71,13.01 U4.1 ; 40.04,12.35 C1.1 39.36,11.66 D3.1 39,9.42 USB1.A4B9 39,5.59 39.12,5.47 39.12,5.21 40.39,3.94 42.93,3.94 43.69,4.7 43.69,5.47 43.8,5.59 USB1.B4A9
$1N5148: length 10.1
  Top Layer w0.254: R1.1 44.22,11.61 41.58,11.61 40.15,10.18 USB1.A5
$1N5149: length 3.9
  Top Layer w0.254: USB1.B5 43.18,6.33 43.18,7.62 43.82,8.26 R2.1
$1N5165: length 2.2
  Top Layer w0.254: LED1.1 46.47,19.25 R5.1
$1N5231: length 6.1
  Top Layer w0.254: LED3.3 30.65,74 30.23,74.42 26.81,74.42 LED2.1
$1N5232: length 8.1
  Top Layer w0.254: v1(32.13,73.91) 32.77,74.55 34.45,74.55 35.13,73.87 35.13,73.21 LED4.3 ; LED3.1 29.55,71.84 v1(30.1,72.39)
  Bottom Layer w0.254: v1(32.13,73.91) 30.61,72.39 v1(30.1,72.39)

## Copper pours and planes (outline as drawn; the poured copper is in the pictures)
GND on Top Layer: -7.75,98.17 107.95,98.17 107.95,-21.59 -7.75,-21.59
GND on Bottom Layer: -4.57,96.9 91.44,96.9 91.44,-16 -4.57,-16
GND on Inner1: -8.51,98.17 95.89,98.17 95.89,-25.65 -8.51,-25.65
GND on Inner2: -17.78,100.96 107.19,100.96 107.19,-30.48 -17.78,-30.48
